# EAGLE design main (EAGLE 7.7.0)
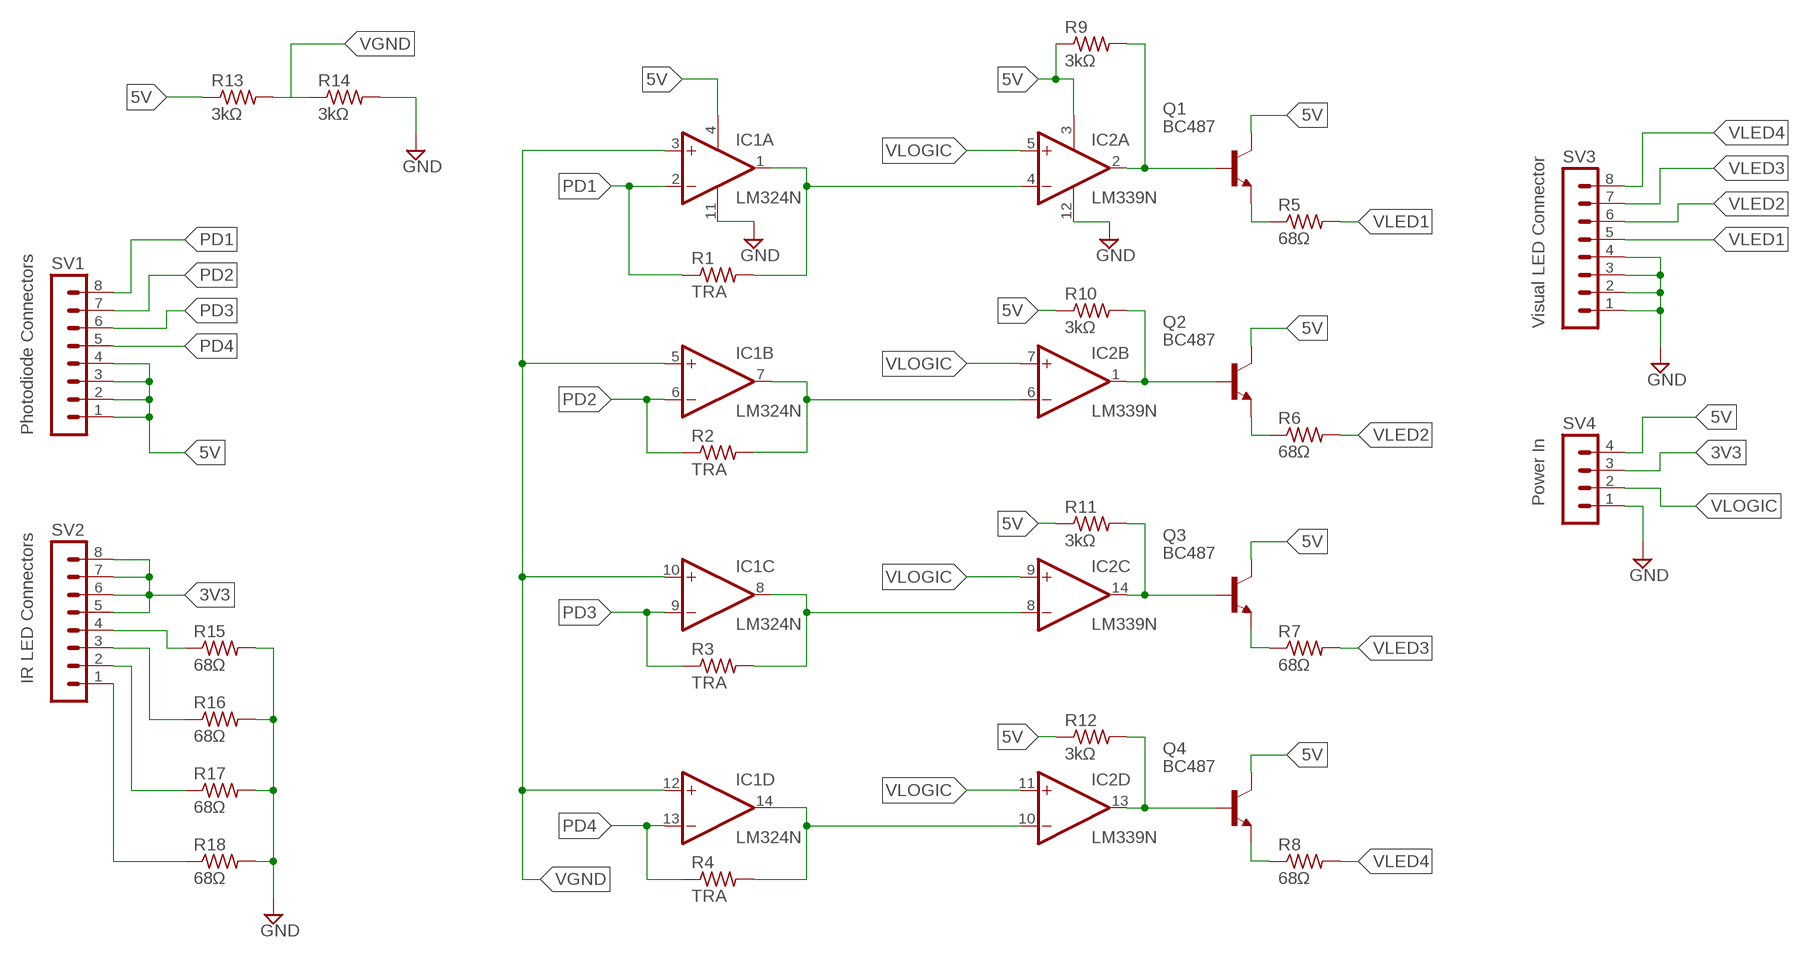
[diagram p0: schematic, sheet 1]

## Parts
IC1  LM324N  [DIL14]
IC2  LM339N  [DIL14]
Q1  BC487  [TO92-EBC]
Q2  BC487  [TO92-EBC]
Q3  BC487  [TO92-EBC]
Q4  BC487  [TO92-EBC]
R1  TRA  R-US_0204/7  [0204/7]
R2  TRA  R-US_0204/7  [0204/7]
R3  TRA  R-US_0204/7  [0204/7]
R4  TRA  R-US_0204/7  [0204/7]
R5  68Ω  R-US_0204/7  [0204/7]
R6  68Ω  R-US_0204/7  [0204/7]
R7  68Ω  R-US_0204/7  [0204/7]
R8  68Ω  R-US_0204/7  [0204/7]
R9  3kΩ  R-US_0204/7  [0204/7]
R10  3kΩ  R-US_0204/7  [0204/7]
R11  3kΩ  R-US_0204/7  [0204/7]
R12  3kΩ  R-US_0204/7  [0204/7]
R13  3kΩ  R-US_0204/7  [0204/7]
R14  3kΩ  R-US_0204/7  [0204/7]
R15  68Ω  R-US_0204/7  [0204/7]
R16  68Ω  R-US_0204/7  [0204/7]
R17  68Ω  R-US_0204/7  [0204/7]
R18  68Ω  R-US_0204/7  [0204/7]
SV1  Photodiode Connectors  MA08-1  [MA08-1]
SV2  IR LED Connectors  MA08-1  [MA08-1]
SV3  Visual LED Connector  MA08-1  [MA08-1]
SV4  Power In  MA04-1  [MA04-1]

## Nets
3V3: SV2.5 SV2.6 SV2.7 SV2.8 SV4.3
5V: IC1.4(P:V+) IC2.3(P:V+) Q1.C Q2.C Q3.C Q4.C R9.1 R10.1 R11.1 R12.1 R13.1 SV1.1 SV1.2 SV1.3 SV1.4 SV4.4
GND: IC1.11(P:V-) IC2.12(P:GND) R14.2 R15.2 R16.2 R17.2 R18.2 SV3.1 SV3.2 SV3.3 SV3.4 SV4.1
N$1: Q1.E R5.1
N$2: IC1.1(A:OUT) IC2.4(A:-IN) R1.2
N$3: IC1.7(B:OUT) IC2.6(B:-IN) R2.2
N$4: Q2.E R6.1
N$5: Q3.E R7.1
N$6: Q4.E R8.1
N$7: IC1.14(D:OUT) IC2.10(D:-IN) R4.2
N$8: IC2.14(C:OUT) Q3.B R11.2
N$9: IC2.13(D:OUT) Q4.B R12.2
N$10: IC2.1(B:OUT) Q2.B R10.2
N$11: IC2.2(A:OUT) Q1.B R9.2
N$12: R15.1 SV2.4
N$13: R16.1 SV2.3
N$14: R17.1 SV2.2
N$15: R18.1 SV2.1
PD1: IC1.2(A:-IN) R1.1 SV1.8
PD2: IC1.6(B:-IN) R2.1 SV1.7
PD3: IC1.9(C:-IN) R3.1 SV1.6
PD4: IC1.13(D:-IN) R4.1 SV1.5
VGND: IC1.3(A:+IN) IC1.5(B:+IN) IC1.10(C:+IN) IC1.12(D:+IN) R13.2 R14.1
VLED1: R5.2 SV3.5
VLED2: R6.2 SV3.6
VLED3: R7.2 SV3.7
VLED4: R8.2 SV3.8
VLOGIC: IC1.8(C:OUT) IC2.5(A:+IN) IC2.7(B:+IN) IC2.8(C:-IN) IC2.9(C:+IN) IC2.11(D:+IN) R3.2 SV4.2

## Library data of the parts
IC1 = linear:LM324: OP AMP
IC2 = linear:LM339: Low Power Low Offset Voltage Quad Comparators with open collector; LM139/LM239/LM339/LM2901/LM3302
Q1-Q4 = transistor-npn:BC487*: NPN Transistor
R1-R18 = resistor:R-US_: RESISTOR, American symbol
SV1-SV3 = con-lstb:MA08-1: PIN HEADER; OC_FARNELL: unknown; OC_NEWARK: unknown
SV4 = con-lstb:MA04-1: PIN HEADER; OC_FARNELL: unknown; OC_NEWARK: unknown

## Board
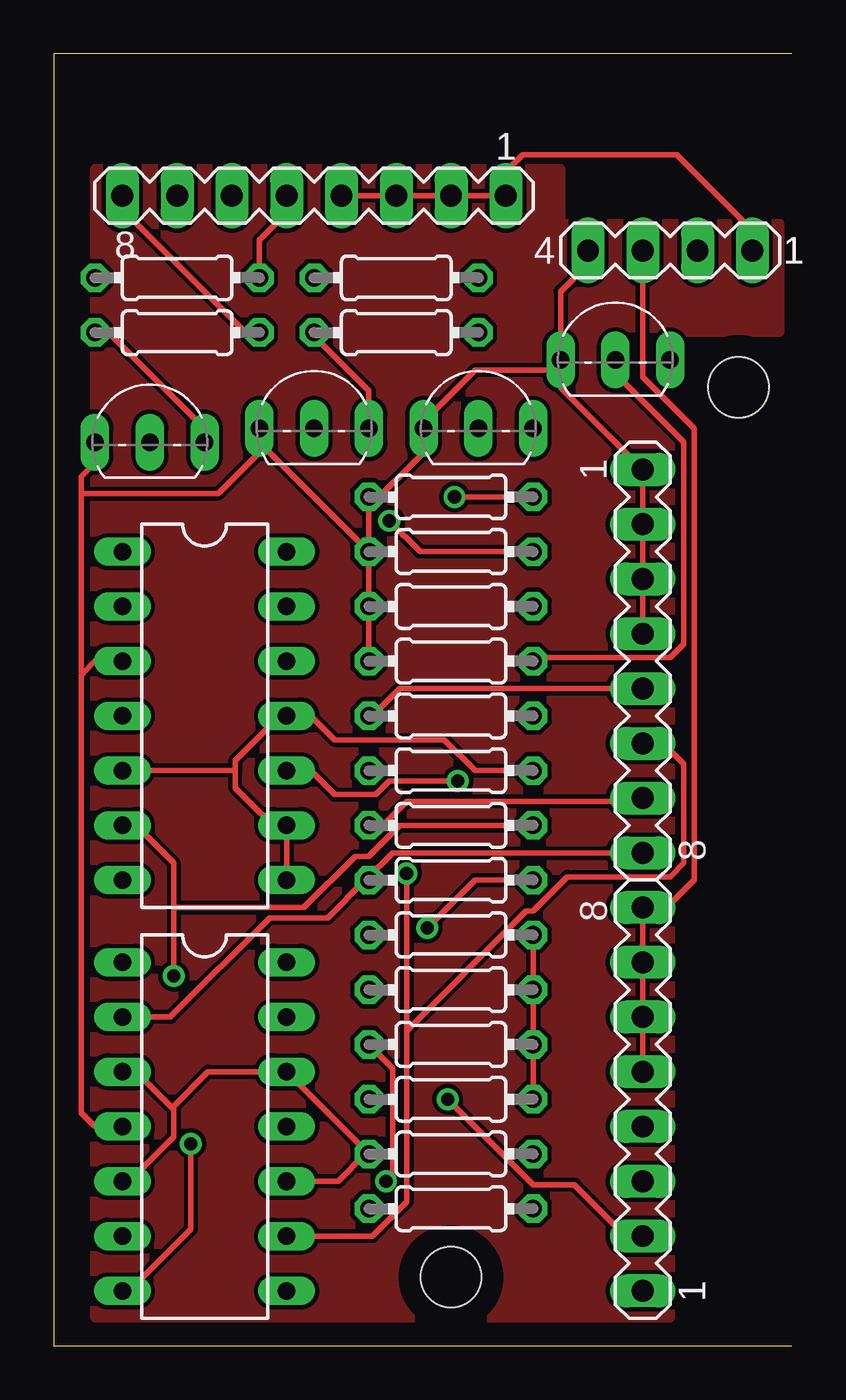
[diagram p1: board, top side]
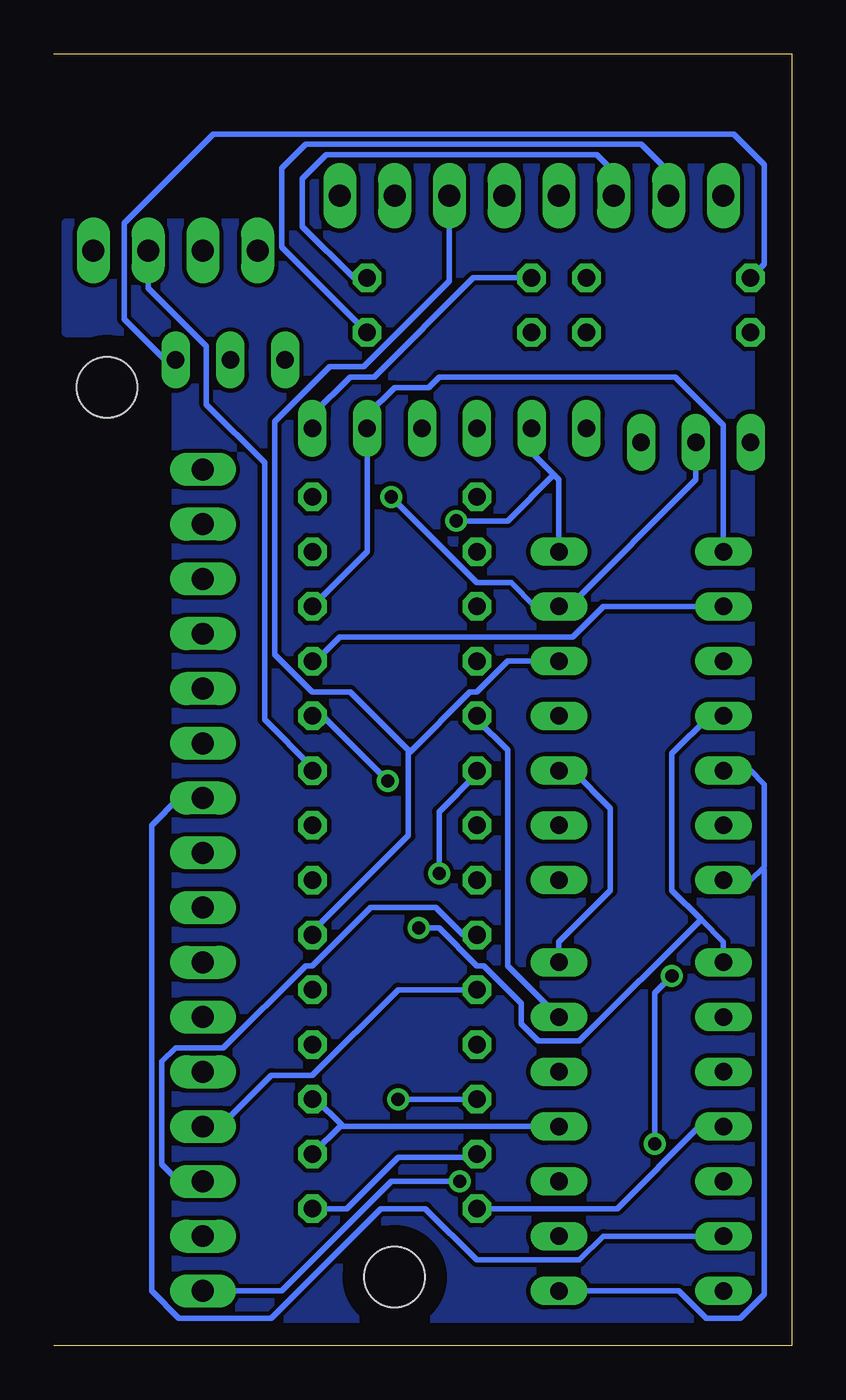
[diagram p2: board, bottom side, seen from below]

Size 34.21 x 59.92 mm. Coordinates in mm from the lower left corner, seen from the top.
Outline: 34.21,0 0,0 0,59.92 34.21,59.92
Copper layers (1*16): Top 0.035mm / dielectric 1.5mm / Bottom 0.035mm
Design rules "default": minimum track width 10mil, minimum drill 24mil, track to track 8mil, track to pad 8mil, pad to pad 8mil, via to via 8mil, smd to smd 8mil, copper to edge 40mil, drill to drill 8mil, minimum pad ring 10mil, minimum via ring 8mil, stop-mask expansion 4mil, vias tented up to drill 0mil, thermal gap 10mil
Holes 2.8 mm at 18.41,3.17 31.75,44.45

### Footprints (pad centres in the part's own frame; a part is rotated, then mirrored left to right if it is on the bottom)
DIL14 = drill 0.813 long: 1 -7.62,-3.81; 2 -5.08,-3.81; 3 -2.54,-3.81; 4 0,-3.81; 5 2.54,-3.81; 6 5.08,-3.81; 7 7.62,-3.81; 8 7.62,3.81; 9 5.08,3.81; 10 2.54,3.81; 11 0,3.81; 12 -2.54,3.81; 13 -5.08,3.81; 14 -7.62,3.81
TO92-EBC = drill 0.813 long: B 0,-1.27; C -2.54,-1.27; E 2.54,-1.27
0204/7 = drill 0.813 octagon: 1 -3.81,0; 2 3.81,0
MA08-1 = drill 1.016 long: 1 -8.89,0; 2 -6.35,0; 3 -3.81,0; 4 -1.27,0; 5 1.27,0; 6 3.81,0; 7 6.35,0; 8 8.89,0
MA04-1 = drill 1.016 long: 1 -3.81,0; 2 -1.27,0; 3 1.27,0; 4 3.81,0

### Placement (x,y rotation side)
IC1  6.99,10.16 270 top
IC2  6.99,29.21 270 top
Q1  26.04,46.99 0 top
Q2  19.68,43.81 0 top
Q3  12.06,43.81 0 top
Q4  4.45,43.18 0 top
R1  18.41,21.59 0 top
R2  18.41,24.13 0 top
R3  18.41,26.67 0 top
R4  18.41,29.21 0 top
R5  5.71,49.53 0 top
R6  15.88,49.53 0 top
R7  15.88,46.99 0 top
R8  5.71,46.99 0 top
R9  18.41,31.75 0 top
R10  18.41,34.29 0 top
R11  18.41,36.83 0 top
R12  18.41,39.37 0 top
R13  18.41,6.35 0 top
R14  18.41,8.89 0 top
R15  18.41,16.51 0 top
R16  18.41,19.05 0 top
R17  18.41,11.43 0 top
R18  18.41,13.97 0 top
SV1  27.3,31.75 270 top
SV2  27.3,11.43 90 top
SV3  12.06,53.34 180 top
SV4  28.57,50.8 180 top

### Tracks (layer width: path | path; a pad name or v marks a point on that pad's centre or on a via)
3V3
  Top 0.254: SV2.5 SV2.6 SV2.7 SV2.8 28.42,20.32 29.69,21.59 29.69,42.55 27.3,44.93 SV4.3
5V
  Top 0.254: R9.1 R10.1 R11.1 | 14.61,38.89 R11.1 | R11.1 9.53,41.91 Q3.C 9.68,41.59 7.62,39.53 1.27,39.53 | 14.61,38.89 17.14,41.43 Q2.C 17.14,42.86 19.53,45.24 23.5,45.24 | 14.61,38.89 R12.1 | SV4.4 24.77,50.16 23.5,48.9 Q1.C 23.5,45.24 | SV1.4 SV1.3 SV1.2 SV1.1 23.5,44.45 23.5,45.24 | IC1.4 1.91,10.16 1.27,10.79 1.27,31.11 1.35,31.19 | 1.35,31.19 1.91,31.75 IC2.3 | Q4.C 1.91,40.96 1.27,40.32 1.27,39.53 | 1.27,39.53 1.27,31.27 1.35,31.19
  Bottom 0.254: R13.1 8.1,6.35 4.29,10.16 IC1.4
GND
  Top 0.254: SV3.4 SV3.3 SV3.2 SV3.1 20.95,54.45 21.75,55.24 28.89,55.24 32.38,51.75 SV4.1 | R16.2 R15.2 R18.2 R17.2
  Bottom 0.254: IC1.11 20.8,10.16 20.88,10.24 | 20.88,10.24 22.07,11.43 R17.2 | 20.88,10.24 R14.2 | IC2.12 13.18,31.75 14.61,30.32 14.92,30.32 17.7,27.54 | 17.7,27.54 17.78,27.46 17.78,23.65 22.23,19.21 R16.2 | SV3.3 15.88,49.37 19.84,45.4 21.43,45.4 23.97,42.86 23.97,32.07 22.23,30.32 20.48,30.32 17.7,27.54
N$1
  Bottom 0.254: R5.1 1.27,50.16 1.27,54.77 2.7,56.2 26.83,56.2 30.96,52.07 30.96,47.62 29.05,45.72 Q1.E
N$2  (via drill 0.61)
  Top 0.254: R1.2 19.53,21.59 v17.3,19.37
  Bottom 0.254: IC1.1 3.17,18.73 4.21,19.76 | 4.21,19.76 5.56,21.11 5.56,27.46 3.81,29.21 IC2.4 | v17.3,19.37 16.35,19.37 14.61,17.62 14.29,17.62 12.54,15.88 12.54,14.92 11.75,14.13 9.84,14.13 4.21,19.76
N$3  (via drill 0.61)
  Top 0.254: IC1.7 3.49,2.54 6.35,5.4 v6.35,9.37 | 5.56,20.32 5.56,22.38 3.81,24.13 IC2.6 | 5.56,20.32 v5.56,17.14 | R2.2 16.03,24.13 14.61,22.7 13.97,22.7 11.59,20.32 5.56,20.32
  Bottom 0.254: v6.35,9.37 6.35,16.35 v5.56,17.14
N$4
  Bottom 0.254: R6.1 14.76,49.53 19.37,44.93 20.48,44.93 22.23,43.18 Q2.E
N$5
  Top 0.254: Q3.E 14.61,44.29 12.06,46.83 R7.1
N$6
  Top 0.254: Q4.E 6.99,42.55 2.54,46.99 R8.1
N$7  (via drill 0.61)
  Top 0.254: v18.73,26.19 15.56,26.19 14.92,25.56 13.02,25.56 11.91,26.67 IC2.10
  Bottom 0.254: IC1.14 10.79,18.73 8.41,21.11 8.41,24.92 10.16,26.67 IC2.10 | R4.2 21.75,29.21 v18.73,26.19
N$8  (via drill 0.61)
  Top 0.254: R11.2 16.99,36.83 v15.56,38.26
  Bottom 0.254: IC2.14 10.79,40.16 11.03,40.4 | 11.03,40.4 12.06,41.43 Q3.B | v15.56,38.26 13.18,38.26 11.03,40.4
N$9  (via drill 0.61)
  Top 0.254: v18.57,39.37 R12.2
  Bottom 0.254: Q4.B 4.45,40.16 10.32,34.29 IC2.13 11.91,34.29 13.02,35.4 14.61,35.4 v18.57,39.37
N$10
  Bottom 0.254: IC2.1 3.17,42.7 5.4,44.93 16.35,44.93 16.83,44.45 18.41,44.45 19.68,43.18 Q2.B 19.68,36.83 R10.2
N$11
  Top 0.254: Q1.B 26.04,45.09 29.21,41.91 29.21,32.54 28.57,31.91 22.38,31.91 R9.2
  Bottom 0.254: IC2.2 8.73,34.29 10.16,32.86 20.95,32.86 22.07,31.75 R9.2
N$12
  Bottom 0.254: R15.1 18.26,16.51 22.23,12.54 24.13,12.54 26.51,10.16 SV2.4
N$13
  Bottom 0.254: R16.1 15.24,19.05 16.51,20.32 19.53,20.32 22.23,17.62 22.54,17.62 26.35,13.81 28.57,13.81 29.21,13.18 29.21,8.41 28.42,7.62 SV2.3
N$14  (via drill 0.61)
  Top 0.254: v18.26,11.43 22.23,7.46 24.13,7.46 26.51,5.08 SV2.2
  Bottom 0.254: v18.26,11.43 R17.1
N$15  (via drill 0.61)
  Top 0.254: R18.1 15.72,12.86 15.72,7.94 v15.4,7.62
  Bottom 0.254: v15.4,7.62 18.57,7.62 23.65,2.54 SV2.1
N$16
  pour Top: 1.91,54.61 23.5,54.61 23.5,52.07 33.66,52.07 33.66,46.99 28.57,46.99 28.57,1.27 1.91,1.27
N$17
  pour Bottom: 1.91,54.61 23.5,54.61 23.5,52.07 33.66,52.07 33.66,46.99 28.57,46.99 28.57,1.27 1.91,1.27
PD1
  Top 0.254: IC1.2 5.4,15.24 10,19.84 12.7,19.84 14.45,21.59 | SV1.8 15.72,22.86 14.45,21.59 | 14.45,21.59 R1.1
PD2
  Top 0.254: R2.1 15.24,24.13 16.35,25.24 27.15,25.24 SV1.7
  Bottom 0.254: IC1.6 8.73,5.08 9.84,3.97 14.61,3.97 16.99,6.35 19.05,6.35 24.13,1.27 28.42,1.27 29.69,2.54 29.69,24.13 28.42,25.4 SV1.7
PD3  (via drill 0.61)
  Top 0.254: IC1.9 14.76,5.08 16.35,6.67 16.35,14.61 | v16.35,21.91 16.35,14.61 | SV1.6 28.26,27.94 29.21,26.99 29.21,22.38 28.57,21.75 23.81,21.75 22.23,20.16 21.91,20.16 16.35,14.61
  Bottom 0.254: v16.35,21.91 16.35,24.77 14.61,26.51 R3.1
PD4
  Top 0.254: SV1.5 16.03,30.48 14.76,29.21 R4.1
  Bottom 0.254: IC1.13 13.18,17.62 13.18,27.62 14.61,29.05 R4.1
VGND
  Top 0.254: IC1.5 3.49,7.62 5.56,9.68 5.56,10.95 5.48,11.03 | 5.48,11.03 3.81,12.7 IC1.3 | 5.48,11.03 7.14,12.7 IC1.12 R14.1 14.45,8.89 13.18,7.62 IC1.10
  Bottom 0.254: R13.2 20.64,6.35 18.26,8.73 14.76,8.73 R14.1
VLED1
  Top 0.254: R5.2 9.53,51.28 10.79,52.55 SV3.5
VLED2
  Bottom 0.254: R6.2 20.32,49.53 22.7,51.91 22.7,54.13 21.59,55.24 9.05,55.24 8.26,54.45 SV3.6
VLED3
  Bottom 0.254: R7.2 23.65,50.96 23.65,54.61 22.54,55.72 6.99,55.72 5.71,54.45 SV3.7
VLED4
  Top 0.254: R8.2 8.89,46.99 3.17,52.7 SV3.8
VLOGIC
  Top 0.254: 10.79,23.5 IC2.8 | 8.41,26.67 8.41,25.88 10.79,23.5 | 8.41,26.67 8.41,27.15 10.48,29.21 IC2.11 11.91,29.21 13.02,28.1 18.1,28.1 19.53,26.67 R3.2 | 10.79,23.5 IC2.9 | 8.41,26.67 IC2.5
  Bottom 0.254: IC2.7 1.91,21.59 1.35,22.15 | 1.35,22.15 1.27,22.23 1.27,26.04 1.91,26.67 IC2.5 | IC1.8 5.24,2.54 3.97,1.27 2.38,1.27 1.27,2.38 1.27,22.07 1.35,22.15 | SV4.2 29.84,49.05 27.15,46.35 27.15,43.66 24.45,40.96 24.45,29.05 22.23,26.83 R3.2

### Text on the board
tValues: V1 | V2 | V3 | V4 | GND | GND | GND | GND | 5V IN | 3V3 IN | V LOG | GND | C | B | E | C | B | E | E | C | B | E | 5V | C | B | 5V | 5V | 5V | PD4 | PD3 | PD2 | PD1 | 3v3 | 3v3 | 3v3 | 3v3 | GND | GND | GND | GND